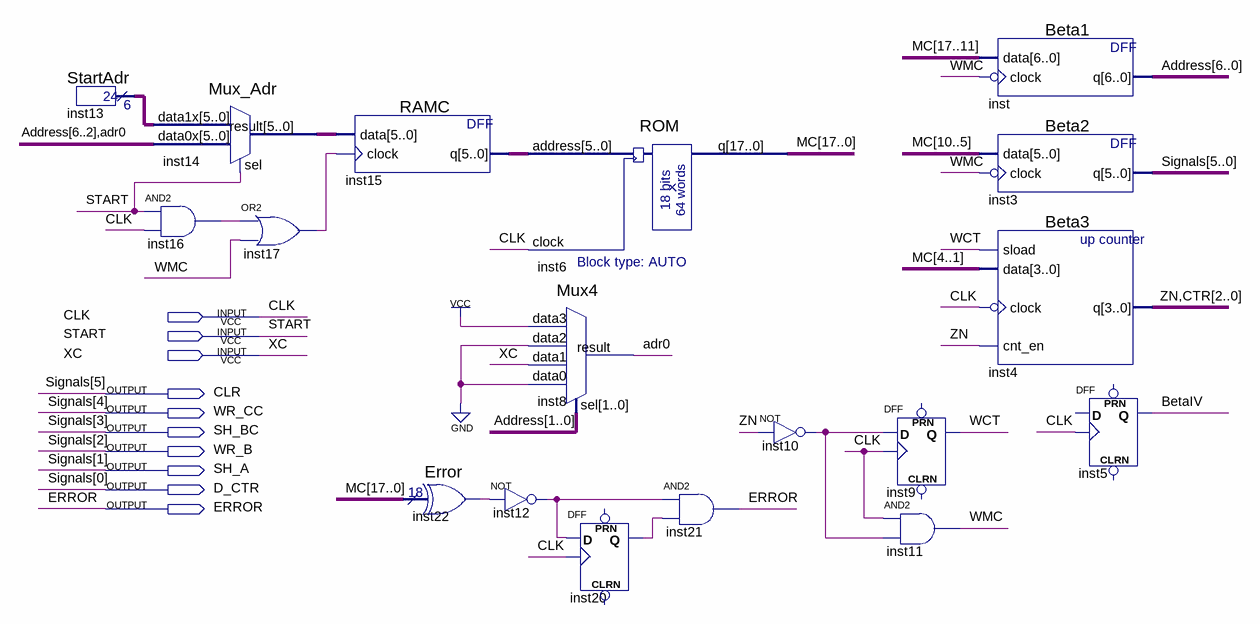
[diagram p0: schematic sheet]
// Quartus schematic BMU.bdf as structural Verilog: 18 symbols, 10 pins
module BMU (
  input  CLK,
  input  START,
  input  XC,
  output CLR,
  output WR_CC,
  output SH_BC,
  output WR_B,
  output SH_A,
  output D_CTR,
  output ERROR
);

  wire adr0, BetaIV, inst10_out, inst12_out, inst16_out, inst17_out, inst20_q, inst22_result, WCT, WMC, ZN;
  wire [2:0] CTR;
  wire [5:0] inst13_result, inst14_result, inst15_q;
  wire [6:0] Address;
  wire [17:0] MC;

  StartAdr inst13 (.result(inst13_result));
  Mux_Adr inst14 (.data1x(inst13_result), .data0x({Address[6:2], adr0}), .sel(START), .result(inst14_result));
  and inst16 (inst16_out, START, CLK);
  or inst17 (inst17_out, inst16_out, WMC);
  RAMC inst15 (.data(inst14_result), .clock(inst17_out), .q(inst15_q));
  Error inst22 (.data(MC), .result(inst22_result));
  ROM inst6 (.address(inst15_q), .clock(CLK), .q(MC));
  Mux4 inst8 (.data3(1'b1), .data2(1'b0), .data1(XC), .data0(1'b0), .sel(Address[1:0]), .result(adr0));
  not inst12 (inst12_out, inst22_result);
  DFF inst20 (.CLK(CLK), .D(inst12_out), .Q(inst20_q));  // open: CLRN, PRN
  and inst21 (ERROR, inst12_out, inst20_q);
  not inst10 (inst10_out, ZN);
  DFF inst9 (.CLK(CLK), .D(inst10_out), .Q(WCT));  // open: CLRN, PRN
  and inst11 (WMC, CLK, inst10_out);
  Beta1 inst (.data(MC[17:11]), .clock(~WMC), .q(Address));
  Beta2 inst3 (.data(MC[10:5]), .clock(~WMC), .q({CLR, WR_CC, SH_BC, WR_B, SH_A, D_CTR}));
  Beta3 inst4 (.sload(WCT), .data(MC[4:1]), .clock(~CLK), .cnt_en(ZN), .q({ZN, CTR}));
  DFF inst5 (.CLK(CLK), .Q(BetaIV));  // open: CLRN, D, PRN

  // Other names for the same wires on the sheet: Signals[5:0] = {CLR, WR_CC, SH_BC, WR_B, SH_A, D_CTR}
endmodule
